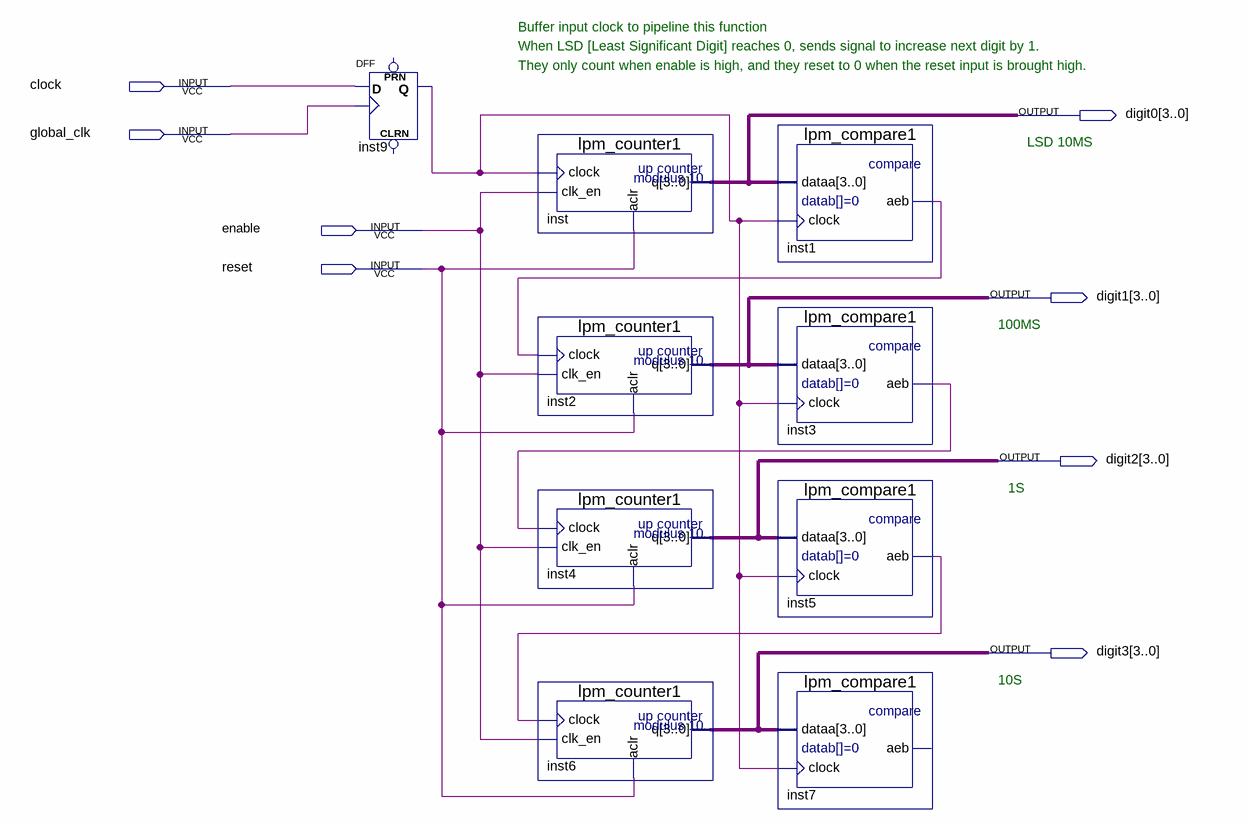
[diagram p0: schematic sheet]
// Quartus schematic BCD_count.bdf as structural Verilog: 9 symbols, 8 pins
module BCD_count (
  input  clock,
  input  global_clk,
  input  enable,
  input  reset,
  output [3:0] digit0,
  output [3:0] digit1,
  output [3:0] digit2,
  output [3:0] digit3
);

  wire inst1_aeb, inst3_aeb, inst5_aeb, inst9_q;

  DFF inst9 (.CLK(global_clk), .D(clock), .Q(inst9_q));  // open: CLRN, PRN
  lpm_counter1 inst (.clock(inst9_q), .clk_en(enable), .aclr(reset), .q(digit0));
  lpm_counter1 inst2 (.clock(inst1_aeb), .clk_en(enable), .aclr(reset), .q(digit1));
  lpm_counter1 inst4 (.clock(inst3_aeb), .clk_en(enable), .aclr(reset), .q(digit2));
  lpm_counter1 inst6 (.clock(inst5_aeb), .clk_en(enable), .aclr(reset), .q(digit3));
  lpm_compare1 inst1 (.dataa(digit0), .clock(inst9_q), .aeb(inst1_aeb));
  lpm_compare1 inst3 (.dataa(digit1), .clock(inst9_q), .aeb(inst3_aeb));
  lpm_compare1 inst5 (.dataa(digit2), .clock(inst9_q), .aeb(inst5_aeb));
  lpm_compare1 inst7 (.dataa(digit3), .clock(inst9_q));  // open: aeb

  // Notes on the sheet:
  //   Buffer input clock to pipeline this function
  //   When LSD [Least Significant Digit] reaches 0, sends signal to increase next digit by 1.
  //   They only count when enable is high, and they reset to 0 when the reset input is brought high.
  //   LSD 10MS
  //   100MS
  //   1S
  //   10S
endmodule
